# EAGLE design AmbientLight-1 (EAGLE 7.2.0)
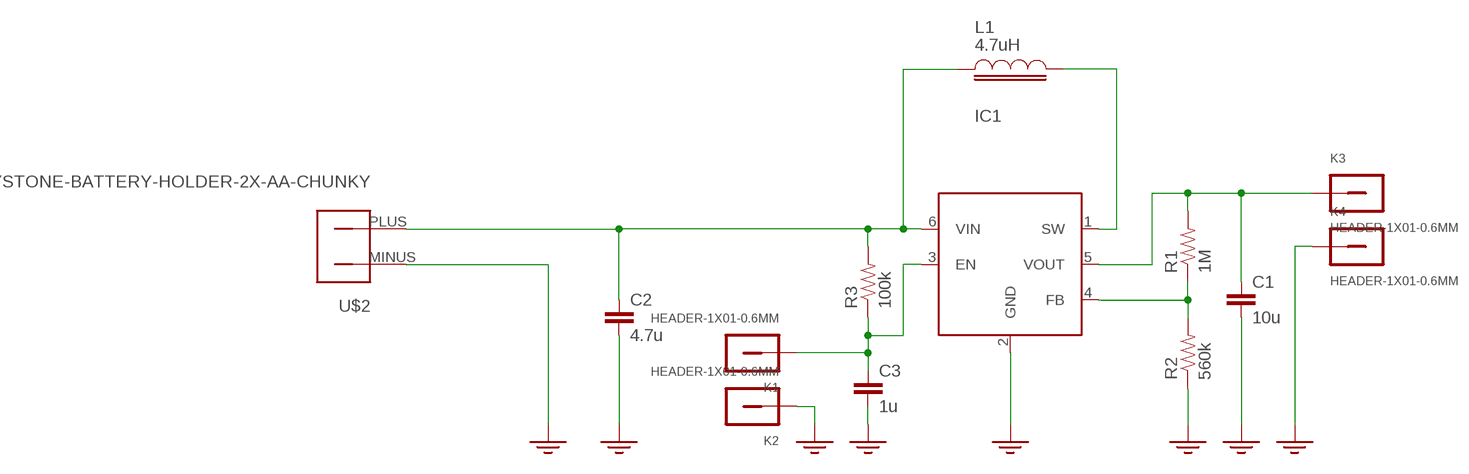
[diagram p0: schematic, sheet 1]

## Parts
C1  10u  CAP-0805-WIDE  [0805-WIDE]
C2  4.7u  CAP-0603-MIN  [0603-MIN]
C3  1u  CAP-0603-MIN  [0603-MIN]
IC1  SWITCHING-REGULATOR-VARIABLE-BOOST-MCP1640  [SOT23-6]
K1  HEADER-1X01-0.6MM  [HEADER-1X01-0.6MM-DIAM]
K2  HEADER-1X01-0.6MM  [HEADER-1X01-0.6MM-DIAM]
K3  HEADER-1X01-0.6MM  [HEADER-1X01-0.6MM-DIAM]
K4  HEADER-1X01-0.6MM  [HEADER-1X01-0.6MM-DIAM]
L1  4.7uH  INDUCTOR-1210-MIN  [1210-INDUCTOR-MIN]
R1  1M  RESISTOR-0603-MIN  [0603-MIN]
R2  560k  RESISTOR-0603-MIN  [0603-MIN]
R3  100k  RESISTOR-0603-MIN  [0603-MIN]
U$2  KEYSTONE-BATTERY-HOLDER-2X-AA-CHUNKY  [KEYSTONE-BATTERY-HOLDER-2X-AA-CHUNKY]

## Nets
EN: C3.2 IC1.3(EN) K1.P$1 R3.1
GND: C1.1 C2.1 C3.1 IC1.2(GND) K2.P$1 K4.P$1 R2.1 U$2.MINUS(PLUS)
VBAT: C2.2 IC1.6(VIN) L1.1 R3.2 U$2.PLUS(MINUS)
VFB: IC1.4(FB) R1.1 R2.2
VOUT: C1.2 IC1.5(VOUT) K3.P$1 R1.2
VSW: IC1.1(SW) L1.2

## Library data of the parts
C1-C3 = Outbreak:CAP
IC1 = Outbreak:SWITCHING-REGULATOR-VARIABLE-BOOST-MCP1640
K1-K4 = Outbreak:HEADER-1X01
L1 = Outbreak:INDUCTOR
R1-R3 = Outbreak:RESISTOR: Resistor Basic schematic elements and footprints for 0603, 1206, and PTH resistors.
U$2 = Outbreak:KEYSTONE-BATTERY-HOLDER

## Board
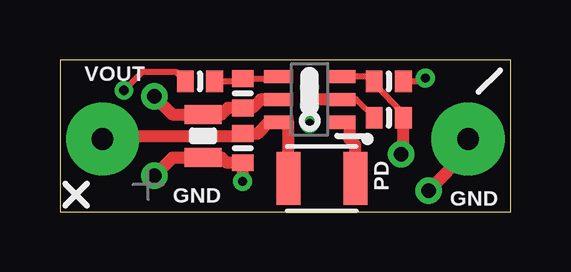
[diagram p1: board, top side]
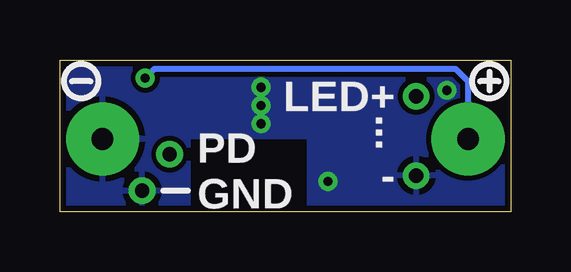
[diagram p2: board, bottom side, seen from below]

Size 18.8 x 6.35 mm. Coordinates in mm from the lower left corner, seen from the top.
Outline: 0,0 18.8,0 18.8,6.35 0,6.35 0,0
Copper layers (1*16): Top 0.035mm / dielectric 1.5mm / Bottom 0.035mm
Design rules "default *": minimum track width 10mil, minimum drill 24mil, track to track 8mil, track to pad 8mil, pad to pad 8mil, via to via 8mil, smd to smd 8mil, copper to edge 10mil, drill to drill 8mil, minimum pad ring 10mil, minimum via ring 8mil, stop-mask expansion 4mil, vias tented up to drill 20mil, thermal gap 10mil

### Footprints (pad centres in the part's own frame; a part is rotated, then mirrored left to right if it is on the bottom)
0805-WIDE = smd 0.8 x 1.524: 1 -0.9,0; 2 0.9,0
0603-MIN = smd 0.7 x 0.9: 1 -0.61,0; 2 0.61,0
SOT23-6 = smd 0.55 x 1.2: 1 0.95,1.3; 2 0,1.3; 3 -0.95,1.3; 4 -0.95,-1.3; 5 0,-1.3; 6 0.95,-1.3
HEADER-1X01-0.6MM-DIAM = drill 0.6: P$1 0,0
1210-INDUCTOR-MIN = smd 1 x 2.2: 1 -1.4,0; 2 1.4,0
KEYSTONE-BATTERY-HOLDER-2X-AA-CHUNKY = drill 0.9 pad 3.048: MINUS -7.62,0; PLUS 7.62,0

### Placement (x,y rotation side)
C1  5.97,3.17 90 top
C2  7.62,2.67 90 top
C3  13.72,3.94 0 top
IC1  10.41,4.7 270 top
K1  14.22,2.41 0 top
K2  15.37,0.89 0 top
K3  3.94,4.83 0 top
K4  3.94,1.52 0 top
L1  10.92,1.4 0 top
R1  7.62,4.95 270 top
R2  5.84,5.46 0 top
R3  13.72,5.46 0 top
U$2  9.4,3.05 180 top

### Tracks (layer width: path | path; a pad name or v marks a point on that pad's centre or on a via)
EN
  Top 0.254: C3.2 14.33,4.12 13.11,5.33 R3.1 12.92,5.65 IC1.3
  Top 0.508: K1.P$1 14.33,2.52 C3.2
GND  (via drill 0.38)
  Top 0.254: IC1.2 12.34,4.7 C3.1 | R2.1 4.85,5.84 3.43,5.84 v2.67,5.08
  Top 0.508: K4.P$1 4.69,2.27 C1.1 6.74,2.27 6.96,2.06 C2.1 v7.62,1.27 | v10.41,4.45 v10.41,3.68 | IC1.2 10.41,4.7 v10.41,4.45 | v10.41,5.21 v10.41,4.45 | K2.P$1 17.02,2.54 U$2.MINUS
  pour Bottom: 0,6.35 18.8,6.35 18.8,0 13.46,0 13.46,3.17 8.38,3.17 8.38,0 0,0
VBAT  (via drill 0.38)
  Top 0.254: R3.2 15.11,5.46 v15.24,5.59
  Top 0.508: L1.1 9.52,3.75 IC1.6 8.7,3.75 8.23,3.28 C2.2 7.52,3.17 1.91,3.17 U$2.PLUS
  Bottom 0.254: v15.24,5.59 14.86,5.97 2.29,5.97 1.78,5.46 U$2.PLUS
VFB
  Top 0.254: IC1.4 9.03,5.56 R1.1 7.52,5.46 R2.2
VOUT
  Top 0.508: IC1.5 8.38,4.7 8.03,4.34 R1.2 7.01,4.34 6.74,4.08 C1.2 4.69,4.08 K3.P$1
VSW
  Top 0.508: IC1.1 12.06,3.75 12.06,3.05 12.32,2.79 L1.2

### Text on the board
tPlace: VOUT | PD | GND | GND
bPlace: LED+ | ... | - | PD | GND